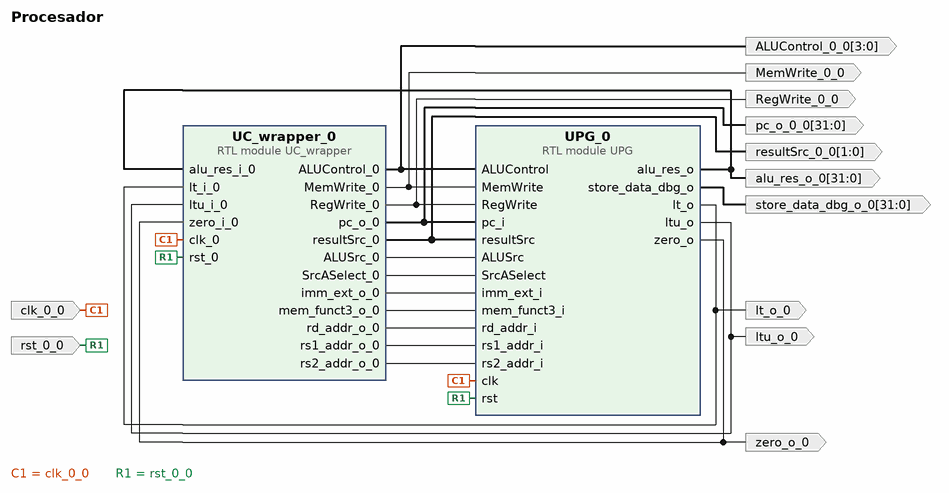
[diagram p0: block diagram of the top level]
# Vivado block design Procesador, xc7a100tcsg324-1, Vivado 2025.1
create_bd_design Procesador

create_bd_port -dir I clk_0_0
create_bd_port -dir I rst_0_0
create_bd_port -dir O lt_o_0
create_bd_port -dir O ltu_o_0
create_bd_port -dir O -from 31 -to 0 pc_o_0_0
create_bd_port -dir O zero_o_0
create_bd_port -dir O MemWrite_0_0
create_bd_port -dir O -from 3 -to 0 ALUControl_0_0
create_bd_port -dir O -from 1 -to 0 resultSrc_0_0
create_bd_port -dir O RegWrite_0_0
create_bd_port -dir O -from 31 -to 0 store_data_dbg_o_0
create_bd_port -dir O -from 31 -to 0 alu_res_o_0

create_bd_cell -type module -reference UPG UPG_0
create_bd_cell -type module -reference UC_wrapper UC_wrapper_0

# ---- connections ----

connect_bd_net [get_bd_pins UC_wrapper_0/ALUControl_0] [get_bd_ports ALUControl_0_0] [get_bd_pins UPG_0/ALUControl]
connect_bd_net [get_bd_pins UC_wrapper_0/ALUSrc_0] [get_bd_pins UPG_0/ALUSrc]
connect_bd_net [get_bd_pins UC_wrapper_0/MemWrite_0] [get_bd_ports MemWrite_0_0] [get_bd_pins UPG_0/MemWrite]
connect_bd_net [get_bd_pins UC_wrapper_0/RegWrite_0] [get_bd_ports RegWrite_0_0] [get_bd_pins UPG_0/RegWrite]
connect_bd_net [get_bd_pins UC_wrapper_0/SrcASelect_0] [get_bd_pins UPG_0/SrcASelect]
connect_bd_net [get_bd_pins UC_wrapper_0/imm_ext_o_0] [get_bd_pins UPG_0/imm_ext_i]
connect_bd_net [get_bd_pins UC_wrapper_0/mem_funct3_o_0] [get_bd_pins UPG_0/mem_funct3_i]
connect_bd_net [get_bd_pins UC_wrapper_0/pc_o_0] [get_bd_ports pc_o_0_0] [get_bd_pins UPG_0/pc_i]
connect_bd_net [get_bd_pins UC_wrapper_0/rd_addr_o_0] [get_bd_pins UPG_0/rd_addr_i]
connect_bd_net [get_bd_pins UC_wrapper_0/resultSrc_0] [get_bd_ports resultSrc_0_0] [get_bd_pins UPG_0/resultSrc]
connect_bd_net [get_bd_pins UC_wrapper_0/rs1_addr_o_0] [get_bd_pins UPG_0/rs1_addr_i]
connect_bd_net [get_bd_pins UC_wrapper_0/rs2_addr_o_0] [get_bd_pins UPG_0/rs2_addr_i]
connect_bd_net [get_bd_pins UPG_0/alu_res_o] [get_bd_ports alu_res_o_0] [get_bd_pins UC_wrapper_0/alu_res_i_0]
connect_bd_net [get_bd_pins UPG_0/lt_o] [get_bd_ports lt_o_0] [get_bd_pins UC_wrapper_0/lt_i_0]
connect_bd_net [get_bd_pins UPG_0/ltu_o] [get_bd_ports ltu_o_0] [get_bd_pins UC_wrapper_0/ltu_i_0]
connect_bd_net [get_bd_pins UPG_0/store_data_dbg_o] [get_bd_ports store_data_dbg_o_0]
connect_bd_net [get_bd_pins UPG_0/zero_o] [get_bd_ports zero_o_0] [get_bd_pins UC_wrapper_0/zero_i_0]
connect_bd_net -net clk_0_0_1 [get_bd_ports clk_0_0] [get_bd_pins UPG_0/clk] [get_bd_pins UC_wrapper_0/clk_0]
connect_bd_net -net rst_0_0_1 [get_bd_ports rst_0_0] [get_bd_pins UPG_0/rst] [get_bd_pins UC_wrapper_0/rst_0]

validate_bd_design
save_bd_design
